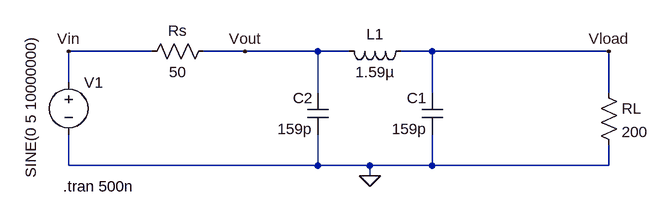
[diagram p0: schematic Pi_Section.asc]
Pi_Section.asc, the LTspice schematic file:
Version 4
SHEET 1 896 680
WIRE 128 48 0 48
WIRE 272 48 208 48
WIRE 384 48 272 48
WIRE 432 48 384 48
WIRE 560 48 512 48
WIRE 832 48 560 48
WIRE 0 96 0 48
WIRE 384 112 384 48
WIRE 560 112 560 48
WIRE 832 112 832 48
WIRE 0 224 0 176
WIRE 384 224 384 176
WIRE 384 224 0 224
WIRE 464 224 384 224
WIRE 560 224 560 176
WIRE 560 224 464 224
WIRE 832 224 832 192
WIRE 832 224 560 224
WIRE 464 240 464 224
FLAG 464 240 0
FLAG 832 48 Vload
FLAG 0 48 Vin
FLAG 272 48 Vout
SYMBOL voltage 0 80 R0
WINDOW 3 -58 -57 VRight 2
WINDOW 123 0 0 Left 2
WINDOW 39 0 0 Left 2
SYMATTR Value SINE(0 5 10000000)
SYMATTR InstName V1
SYMBOL res 224 32 R90
WINDOW 0 0 56 VBottom 2
WINDOW 3 32 56 VTop 2
SYMATTR InstName Rs
SYMATTR Value 50
SYMBOL res 816 96 R0
SYMATTR InstName RL
SYMATTR Value 200
SYMBOL cap 576 176 R180
WINDOW 0 24 56 Left 2
WINDOW 3 24 8 Left 2
SYMATTR InstName C1
SYMATTR Value 159p
SYMBOL cap 400 176 R180
WINDOW 0 24 56 Left 2
WINDOW 3 24 8 Left 2
SYMATTR InstName C2
SYMATTR Value 159p
SYMBOL ind 528 32 R90
WINDOW 0 5 56 VBottom 2
WINDOW 3 32 56 VTop 2
SYMATTR InstName L1
SYMATTR Value 1.59µ
TEXT -8 256 Left 2 !.tran 500n

The netlist it stands for:
* Pi_Section.asc
V1 Vin 0 SINE(0 5 10000000)
Rs Vout Vin 50
RL Vload 0 200
C1 0 Vload 159p
C2 0 Vout 159p
L1 Vload Vout 1.59µ
.tran 500n
.backanno
.end

* Results of the author's LTspice run, read from the files saved beside the schematic
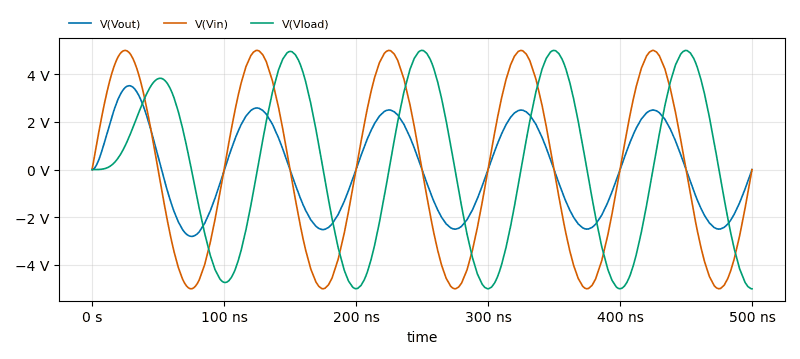
[diagram p1: Transient Analysis of Pi_Section.asc, plotted from the saved traces]
* Transient Analysis, 1 run:
*   V(Vout): min -2.802 V, max 3.517 V, average 48.02 mV, rms 1.865 V, last -3.541 mV
*   V(Vin): min -4.999 V, max 4.999 V, average 380.7 µV, rms 3.533 V, last 0 V
*   V(Vload): min -5 V, max 4.999 V, average 127 mV, rms 3.355 V, last -5 V